# EAGLE schematic quad_sensor_board_v3 (EAGLE 9.0.0)
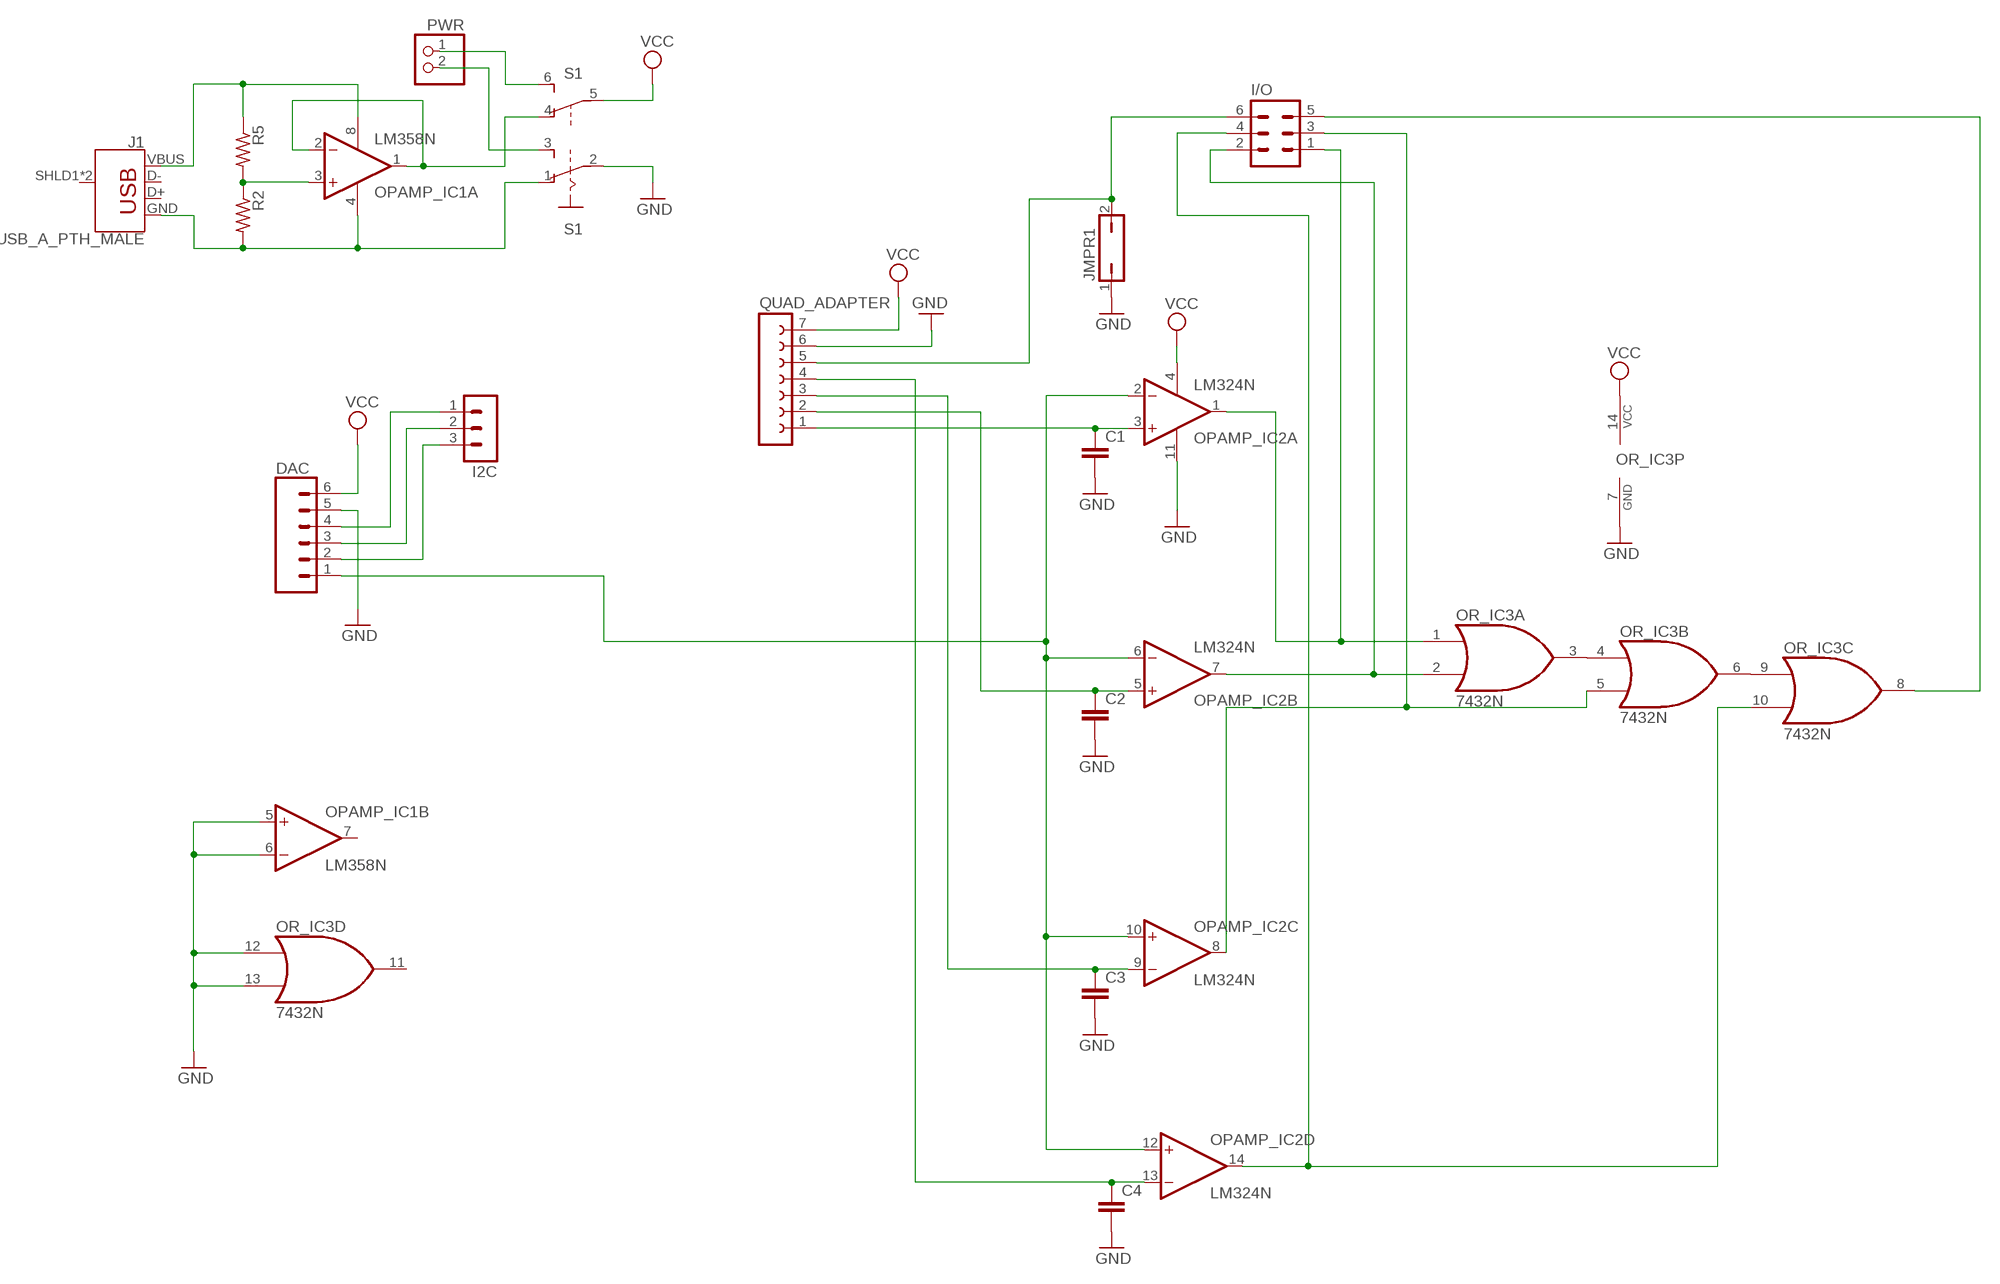
[diagram p0: schematic, sheet 1]

## Parts
C1  C5/3  [C5B3]
C2  C5/3  [C5B3]
C3  C5/3  [C5B3]
C4  C5/3  [C5B3]
DAC  CONN_06NO_SILK_NO_POP  [1X06_NO_SILK]
I2C  MA03-1  [MA03-1]
I/O  MA03-2  [MA03-2]
J1  USB_A_PTH_MALE  [USB-A-H]
JMPR1  JP1Q  [JP1]
OPAMP_IC1  LM358N  [DIL08]
OPAMP_IC2  LM324N  [DIL14]
OR_IC3  7432N  [DIL14]
PWR  PINHD-1X2  [1X02]
QUAD_ADAPTER  FE07-1  [FE07]
R2  R-US_0204/7  [0204/7]
R5  R-US_0204/7  [0204/7]
S1  A68-A31  [A68-A31]

## Nets
GND: C1.2 C2.2 C3.2 C4.2 DAC.5 JMPR1.1 OPAMP_IC1.5(B:+IN) OPAMP_IC1.6(B:-IN) OPAMP_IC2.11(P:V-) OR_IC3.7(P:GND) OR_IC3.12(D:I0) OR_IC3.13(D:I1) QUAD_ADAPTER.6 S1.2(A:P)
N$1: OPAMP_IC1.3(A:+IN) R2.1 R5.2
N$2: J1.VBUS OPAMP_IC1.8(P:V+) R5.1
N$3: OR_IC3.3(A:O) OR_IC3.4(B:I0)
N$4: I/O.4 OPAMP_IC2.14(D:OUT) OR_IC3.10(C:I1)
N$5: OPAMP_IC1.1(A:OUT) OPAMP_IC1.2(A:-IN) S1.4(B:O)
N$6: OR_IC3.6(B:O) OR_IC3.9(C:I0)
N$7: DAC.4 I2C.1
N$8: DAC.3 I2C.2
N$9: DAC.2 I2C.3
N$11: I/O.1 OPAMP_IC2.1(A:OUT) OR_IC3.1(A:I0)
N$13: J1.GND OPAMP_IC1.4(P:V-) R2.2 S1.1(A:O)
N$14: PWR.2 S1.3(A:S)
N$15: PWR.1 S1.6(B:S)
OR_PIN: I/O.5 OR_IC3.8(C:O)
RX_1: C1.1 OPAMP_IC2.3(A:+IN) QUAD_ADAPTER.1
RX_2: C2.1 OPAMP_IC2.5(B:+IN) QUAD_ADAPTER.2
RX_3: C3.1 OPAMP_IC2.9(C:-IN) QUAD_ADAPTER.3
RX_4: C4.1 OPAMP_IC2.13(D:-IN) QUAD_ADAPTER.4
RX_PIN1: I/O.3 OPAMP_IC2.8(C:OUT) OR_IC3.5(B:I1)
RX_PIN2: I/O.2 OPAMP_IC2.7(B:OUT) OR_IC3.2(A:I1)
THRESH: DAC.1 OPAMP_IC2.2(A:-IN) OPAMP_IC2.6(B:-IN) OPAMP_IC2.10(C:+IN) OPAMP_IC2.12(D:+IN)
TX_1: I/O.6 JMPR1.2 QUAD_ADAPTER.5
VCC: DAC.6 OPAMP_IC2.4(P:V+) OR_IC3.14(P:VCC) QUAD_ADAPTER.7 S1.5(B:P)
Unconnected: J1.D+ J1.D- J1.SHLD1(SHIELD) J1.SHLD2(SHIELD) OPAMP_IC1.7(B:OUT) OR_IC3.11(D:O)

## Library data of the parts
C1-C4 = capacitor-wima:C: CAPACITOR naming: grid - package width
DAC = SparkFun-Connectors:CONN_06: Multi connection point. Often used as Generic Header-pin footprint for 0.1 inch spaced/style header connections On any of the 0.1 inch spaced packages, you can populate with these: Break Away Headers - Straight <https://www.sparkfun.com/products/116> (PRT-00116) Break Away Male Headers - Right Angle <https://www.sparkfun.com/products/553> (PRT-00553) Female Headers <https://www.sparkfun.com/products/115> (PRT-00115) Break Away Headers - Machine Pin <https://www.sparkfun.com/products/117> (PRT-00117) Break Away Female Headers - Swiss Machine Pin <https://www.sparkfun.com/products/743> (PRT-00743) Arduino Stackable Header - 6 Pin <https://www.sparkfun.com/products/9280> (PRT-09280) For SCREWTERMINALS and SPRING TERMINALS visit here: Screw Terimnals on SparkFun.com <https://www.sparkfun.com/search/results?term=Screw+Terminals> (5mm/3.5mm/2.54mm spacing) This device is also useful as a general connection point to wire up your design to another part of your project. Our various solder wires solder well into these plated through hole pads. Hook-Up Wire - Assortment (Stranded, 22 AWG) <https://www.sparkfun.com/products/11375> (PRT-11375) Hook-Up Wire - Assortment (Solid Core, 22 AWG) <https://www.sparkfun.com/products/11367> (PRT-11367) View the entire wire category on our website here <https://www.sparkfun.com/categories/141>
I2C = con-lstb:MA03-1: PIN HEADER; OC_FARNELL: unknown; OC_NEWARK: unknown
I/O = con-lstb:MA03-2: PIN HEADER; OC_FARNELL: unknown; OC_NEWARK: unknown
J1 = SparkFun-Connectors:USB_A: USB-A Connector Male and female variants, as well as PTH and SMT variants SparkFun Products: SparkFun XBee Explorer Dongle <https://www.sparkfun.com/products/11697> PTH Male SparkFun MicroView-USB Programmer <https://www.sparkfun.com/products/12924> SMT Male SparkFun USB Type A Female Breakout <https://www.sparkfun.com/products/12700> SMT Female; PROD_ID: CONN-08367; SF_ID: PRT-00437
JMPR1 = jumper:JP1Q: JUMPER
OPAMP_IC1 = linear:LM358: OP AMP also LM158; LM258; LM2904 Source: http://cache.national.com/ds/LM/LM158.pdf
OPAMP_IC2 = linear:LM324: OP AMP
OR_IC3 = 74xx-us:74*32: Quad 2-input OR gate
PWR = pinhead:PINHD-1X2: PIN HEADER
QUAD_ADAPTER = con-lsta:FE07-1: FEMALE HEADER; OC_FARNELL: unknown; OC_NEWARK: unknown
R2 R5 = resistor:R-US_: RESISTOR, American symbol
S1 = switch:A68-A31: SLIDING SWITCH Siemens, distributor Buerklin, 11G766